# EAGLE design LBriduino (EAGLE 8.5.2)
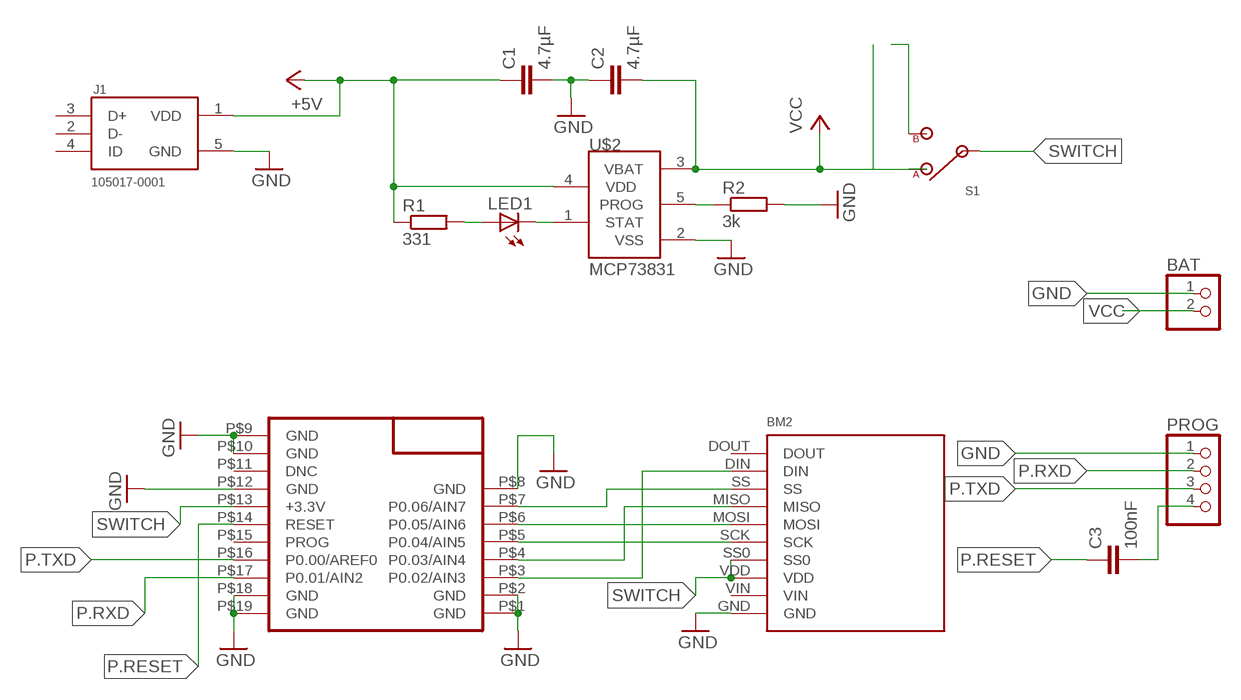
[diagram p0: schematic, sheet 1]

## Parts
BAT  PINHD-1X2  [1X02]
BM2  BM019  [BM019]
C1  4.7µF  C-EUC0603  [C0603]
C2  4.7µF  C-EUC0603  [C0603]
C3  100nF  C-EUC0603  [C0603]
J1  105017-0001  [MOLEX_105017-0001]
LED1  LEDCHIP-LED0603  [CHIP-LED0603]
PROG  PINHD-1X4  [1X04]
R1  331  R-EU_R0603  [R0603]
R2  3k  R-EU_R0603  [R0603]
S1  STS121PC04  [STS121PC04]
U$1  RFD22301  [RFD21733]
U$2  MCP73831  [SOT23-5L]

## Nets
+5V: C1.1 J1.1(VDD) R1.1 U$2.4(VDD)
GND: BAT.1 BM2.GND C1.2 C2.1 J1.5(GND) PROG.1 R2.2 U$1.P$1(GND) U$1.P$2(GND) U$1.P$8(GND) U$1.P$9(GND) U$1.P$10(GND) U$1.P$12(GND) U$1.P$18(GND) U$1.P$19(GND) U$2.2(VSS)
IRQ: BM2.DIN U$1.P$3(P0.02/AIN3)
MISO: BM2.MISO U$1.P$4(P0.03/AIN4)
MOSI: BM2.MOSI U$1.P$6(P0.05/AIN6)
N$1: LED1.A R1.2
N$2: LED1.C U$2.1(STAT)
N$3: C3.2 PROG.4
N$6: R2.1 U$2.5(PROG)
P.RESET: C3.1 U$1.P$14(RESET)
P.RXD: PROG.2 U$1.P$17(P0.01/AIN2)
P.TXD: PROG.3 U$1.P$16(P0.00/AREF0)
SCK: BM2.SCK U$1.P$5(P0.04/AIN5)
SS: BM2.SS U$1.P$7(P0.06/AIN7)
SWITCH: BM2.SS0 BM2.VDD S1.2 U$1.P$13(+3.3V)
TEST: S1.3
VCC: BAT.2 C2.2 S1.1 U$2.3(VBAT)
Unconnected: BM2.DOUT BM2.VIN J1.2(D-) J1.3(D+) J1.4(ID) U$1.P$11(DNC) U$1.P$15(PROG)

## Library data of the parts
BAT = pinhead:PINHD-1X2: PIN HEADER
BM2 = Solutions Cubed:BM019
C1-C3 = resistor:C-EU: CAPACITOR, European symbol
J1 = 105017-0001:105017-0001; AVAILABILITY: Good; DESCRIPTION: Conn USB Type B M 5 POS 0.65mm Solder RA Thru-Hole 5 Terminal 1 Port Embossed T/R; MF: Molex; MP: 105017-0001; PACKAGE: None; PRICE: 0.53 USD
LED1 = led:LED: LED OSRAM: - CHIPLED LG R971, LG N971, LY N971, LG Q971, LY Q971, LO R971, LY R971 LH N974, LH R974 LS Q976, LO Q976, LY Q976 LO Q996 - Hyper CHIPLED LW Q18S LB Q993, LB Q99A, LB R99A - SideLED LS A670, LO A670, LY A670, LG A670, LP A670 LB A673, LV A673, LT A673, LW A673 LH A674 LY A675 LS A676, LA A676, LO A676, LY A676, LW A676 LS A679, LY A679, LG A679 - Hyper Micro SIDELED® LS Y876, LA Y876, LO Y876, LY Y876 LT Y87S - SmartLED LW L88C, LW L88S LB L89C, LB L89S, LG L890 LS L89K, LO L89K, LY L89K LS L896, LA L896, LO L896, LY L896 - TOPLED LS T670, LO T670, LY T670, LG T670, LP T670 LSG T670, LSP T670, LSY T670, LOP T670, LYG T670 LG T671, LOG T671, LSG T671 LB T673, LV T673, LT T673, LW T673 LH T674 LS T676, LA T676, LO T676, LY T676, LB T676, LH T676, LSB T676, LW T676 LB T67C, LV T67C, LT T67C, LS T67K, LO T67K, LY T67K, LW E67C LS E67B, LA E67B, LO E67B, LY E67B, LB E67C, LV E67C, LT E67C LW T67C LS T679, LY T679, LG T679 LS T770, LO T770, LY T770, LG T770, LP T770 LB T773, LV T773, LT T773, LW T773 LH T774 LS E675, LA E675, LY E675, LS T675 LS T776, LA T776, LO T776, LY T776, LB T776 LHGB T686 LT T68C, LB T68C - Hyper Mini TOPLED® LB M676 - Mini TOPLED Santana® LG M470 LS M47K, LO M47K, LY M47K Source: http://www.osram.convergy.de LUXEON: - LUMILED® LXK2-PW12-R00, LXK2-PW12-S00, LXK2-PW14-U00, LXK2-PW14-V00 LXK2-PM12-R00, LXK2-PM12-S00, LXK2-PM14-U00 LXK2-PE12-Q00, LXK2-PE12-R00, LXK2-PE12-S00, LXK2-PE14-T00, LXK2-PE14-U00 LXK2-PB12-K00, LXK2-PB12-L00, LXK2-PB12-M00, LXK2-PB14-N00, LXK2-PB14-P00, LXK2-PB14-Q00 LXK2-PR12-L00, LXK2-PR12-M00, LXK2-PR14-Q00, LXK2-PR14-R00 LXK2-PD12-Q00, LXK2-PD12-R00, LXK2-PD12-S00 LXK2-PH12-R00, LXK2-PH12-S00 LXK2-PL12-P00, LXK2-PL12-Q00, LXK2-PL12-R00 Source: www.luxeon.com KINGBRIGHT: KA-3528ASYC Source: www.kingbright.com
PROG = pinhead:PINHD-1X4: PIN HEADER
R1 R2 = resistor:R-EU_: RESISTOR, European symbol
S1 = switches:STS121PC04: Slide Switch SPDT Through Hole; DIGIKEY: 450-1609-ND
U$1 = RFD22301-11.25.13:RFD22301: RF Digital RFD22301
U$2 = mcp73831:MCP73831: Miniature Single-Cell, Fully Integrated Li-Ion, Li-Polymer Charge Management Controllers

## Net classes
0 default: width 0.305 mm, drill 0.635 mm, clearance 0.254 mm

## Board
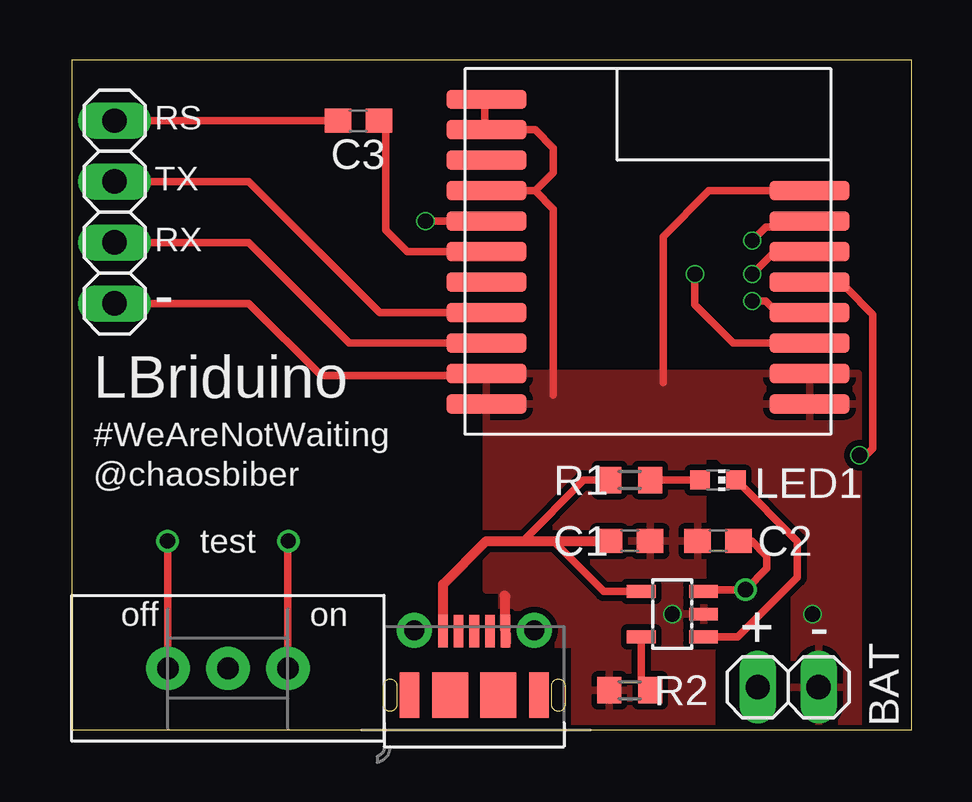
[diagram p1: board, top side]
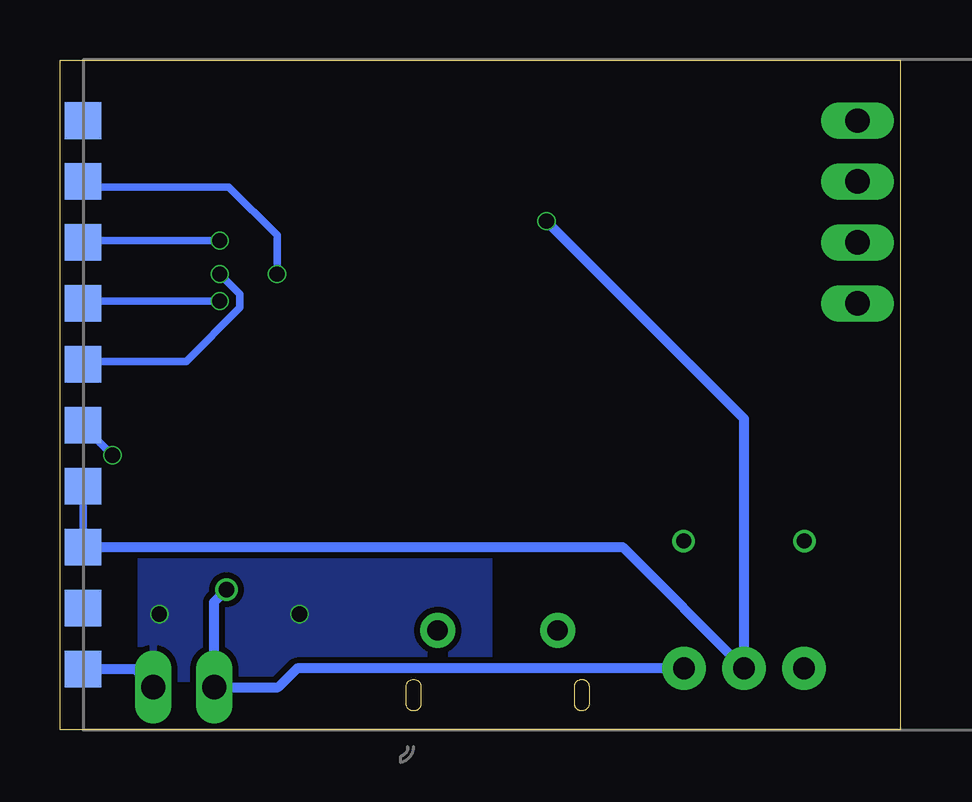
[diagram p2: board, bottom side, seen from below]

Size 35 x 27.93 mm. Coordinates in mm from the lower left corner, seen from the top.
Outline: 0,0 35,0 35,27.93 0,27.93 0,0
Copper layers (1*16): Top 0.035mm / dielectric 1.5mm / Bottom 0.035mm
Design rules "aisler_go_2layer": minimum track width 0.1mm, minimum drill 0.2mm, track to track 0.1mm, track to pad 0.1mm, pad to pad 0.1mm, via to via 0.1mm, smd to smd 0.1mm, copper to edge 0.2mm, drill to drill 0.21mm, minimum pad ring 0.25mm, minimum via ring 0.05mm, stop-mask expansion 0.01mm, vias tented up to drill 0mil, thermal gap 10mil

### Footprints (pad centres in the part's own frame; a part is rotated, then mirrored left to right if it is on the bottom)
1X02 = drill 1.016 long: 1 -1.27,0; 2 1.27,0
BM019 = smd 1.524 x 1.524: DIN -19.05,8.89; DOUT -19.05,11.43; GND -19.05,-11.43; MISO -19.05,3.81; MOSI -19.05,1.27; SCK -19.05,-1.27; SS -19.05,6.35; SS0 -19.05,-3.81; VDD -19.05,-6.35; VIN -19.05,-8.89
C0603 = smd 1.1 x 1: 1 -0.85,0; 2 0.85,0
MOLEX_105017-0001 = smd 0.4 x 1.35: 1 -1.3,2.675; 2 -0.65,2.675; 3 0,2.675; 4 0.65,2.675; 5 1.3,2.675 | drill 0.85 pad 1.45: P$1 -2.5,2.7; P$2 2.5,2.7 | smd 1.5 x 1.9: P$8 -1,0; P$9 1,0 | smd 0.809 x 1.9: P$10 -2.705,0; P$11 2.705,0
CHIP-LED0603 = smd 0.8 x 0.8: A 0,-0.75; C 0,0.75
1X04 = drill 1.016 long: 1 -3.81,0; 2 -1.27,0; 3 1.27,0; 4 3.81,0
R0603 = smd 1 x 1.1: 1 -0.85,0; 2 0.85,0
STS121PC04 = drill 0.9 pad 1.8: 1 -2.5,0; 2 0,0; 3 2.5,0
RFD21733 = smd 3.353 x 0.813: P$1 -6.731,6.35; P$2 -6.731,5.08; P$3 -6.731,3.81; P$4 -6.731,2.54; P$5 -6.731,1.27; P$6 -6.731,0; P$7 -6.731,-1.27; P$8 -6.731,-2.54; P$9 6.731,-6.35; P$10 6.731,-5.08; P$11 6.731,-3.81; P$12 6.731,-2.54; P$13 6.731,-1.27; P$14 6.731,0; P$15 6.731,1.27; P$16 6.731,2.54; P$17 6.731,3.81; P$18 6.731,5.08; P$19 6.731,6.35
SOT23-5L = smd 0.533 x 1.2: 1 -0.95,-1.3; 2 0,-1.3; 3 0.95,-1.3 | smd 0.55 x 1.2: 4 0.95,1.3; 5 -0.95,1.3

### Placement (x,y rotation side)
BAT  29.84,1.78 180 top
BM2  14.99,13.97 0 bottom
C1  23.24,7.87 0 top
C2  26.92,7.87 0 top
C3  11.94,25.4 180 top
J1  16.76,1.45 0 top
LED1  26.92,10.41 270 top
PROG  1.78,21.59 90 top
R1  23.24,10.41 0 top
R2  23.24,1.65 180 top
S1  6.5,2.57 180 top
U$1  24,19.94 180 top
U$2  25.02,4.83 90 top

### Tracks (layer width: path | path; a pad name or v marks a point on that pad's centre or on a via)
+5V
  Top 0.305: J1.1 15.51,4.12 | 18.47,7.87 18.8,7.87 | 18.8,7.87 20.07,7.87 | 20.07,7.87 C1.1 | 18.8,7.87 21.34,10.41 R1.1 | 20.07,7.87 22.16,5.78 U$2.4
  Top 0.406: J1.1 15.46,6.07 17.27,7.87 C1.1
GND  (via drill 0.64)
  Top 0.305: U$1.P$10 17.21,25.08 17.21,26.19 U$1.P$9 | 17.21,13.65 U$1.P$19 | U$1.P$18 17.21,14.76 10.38,14.76 7.37,17.78 PROG.1 | 17.37,24.92 U$1.P$10 | U$1.P$12 19.3,22.48 | 19.3,22.48 20.07,23.24 20.07,24.26 19.3,25.02 U$1.P$10 | 19.3,22.48 20.07,21.72 20.07,13.97 | J1.5 18.13,4 18.13,3.63 | U$1.P$8 26.54,22.48 24.64,20.57 24.64,14.48
  Top 0.406: J1.5 18.06,5.56 18.03,5.59
  Bottom 0.406: BM2.GND 31.88,2.54 BAT.1
  other vias: 25.02,4.83 30.86,4.83
  pour Top: 17.27,14.86 17.27,5.84 17.91,5.84 17.91,3.56 20.95,3.56 20.95,0.25 26.67,0.25 26.67,3.05 26.67,5.84 26.29,5.84 26.29,14.86
  pour Top: 26.29,14.86 32.77,14.86 32.77,0.25 30.1,0.25 30.1,8.26 26.92,11.43 26.29,11.43
  pour Bottom: 17.14,7.24 17.14,2.16 31.62,2.16 31.62,7.24
IRQ  (via drill 0.64)
  Top 0.305: 30.58,16.2 U$1.P$3 27.56,16.13 25.96,17.73 v25.96,19
  Bottom 0.305: BM2.DIN 33.93,22.63 30.23,22.63 29.46,22.63 27.97,22.63 25.96,20.62 v25.96,19
MISO  (via drill 0.64)
  Top 0.305: v28.35,17.88 28.91,17.88 29.19,17.6 30.58,17.6 U$1.P$4
  Bottom 0.305: v28.35,17.88 33.93,17.88 BM2.MISO
MOSI  (via drill 0.64)
  Top 0.305: v28.35,19 29.19,19.84 30.58,19.84 U$1.P$6
  Bottom 0.305: v28.35,19 27.51,18.16 27.51,17.6 29.74,15.37 33.93,15.37 BM2.MOSI
N$1
  Top 0.305: R1.2 LED1.A
N$2
  Top 0.305: U$2.1 27.75,3.88 30.23,6.35 30.23,7.86 LED1.C
N$3
  Top 0.305: PROG.4 C3.2
N$6
  Top 0.305: R2.1 23.72,2.02 U$2.5
P.RESET
  Top 0.305: U$1.P$14 13.97,19.94 13.08,20.83 13.08,25.18 C3.1
P.RXD
  Top 0.305: U$1.P$17 11.56,16.13 7.37,20.32 PROG.2
P.TXD
  Top 0.305: U$1.P$16 12.83,17.4 7.37,22.86 PROG.3
SCK  (via drill 0.64)
  Top 0.305: v32.82,11.46 33.1,11.46 33.38,11.73 33.38,17.32 32.26,18.44 30.86,18.44 U$1.P$5
  Bottom 0.305: v32.82,11.46 33.93,12.57 BM2.SCK
SS  (via drill 0.64)
  Top 0.305: v28.35,20.4 28.91,20.95 30.58,20.95 U$1.P$7
  Bottom 0.305: v28.35,20.4 33.93,20.4 BM2.SS
SWITCH  (via drill 0.64)
  Top 0.305: v14.73,21.21 U$1.P$13
  Bottom 0.305: BM2.SS0 BM2.VDD
  Bottom 0.406: v14.73,21.21 6.5,12.98 S1.2 11.56,7.62 BM2.VDD
TEST  (via drill 0.64 pad 0.94)
  Top 0.305: v3.99,7.87 3.99,2.58 S1.3
VCC  (via drill 0.64 pad 0.94)
  Top 0.305: U$2.3 26.39,5.84 v28.07,5.84 28.96,6.73 28.96,7.24 28.32,7.87 C2.2 | v9.02,7.87 9,7.86 S1.1
  Bottom 0.406: S1.1 25.12,2.56 25.91,1.78 BAT.2 28.58,5.33 v28.07,5.84

### Text on the board
tNames: RS | TX | RX | - | LBriduino | #WeAreNotWaiting | @chaosbiber | test | off | on | + | -